# EAGLE schematic bend_it_board_v_2_F (EAGLE 9.3.1)
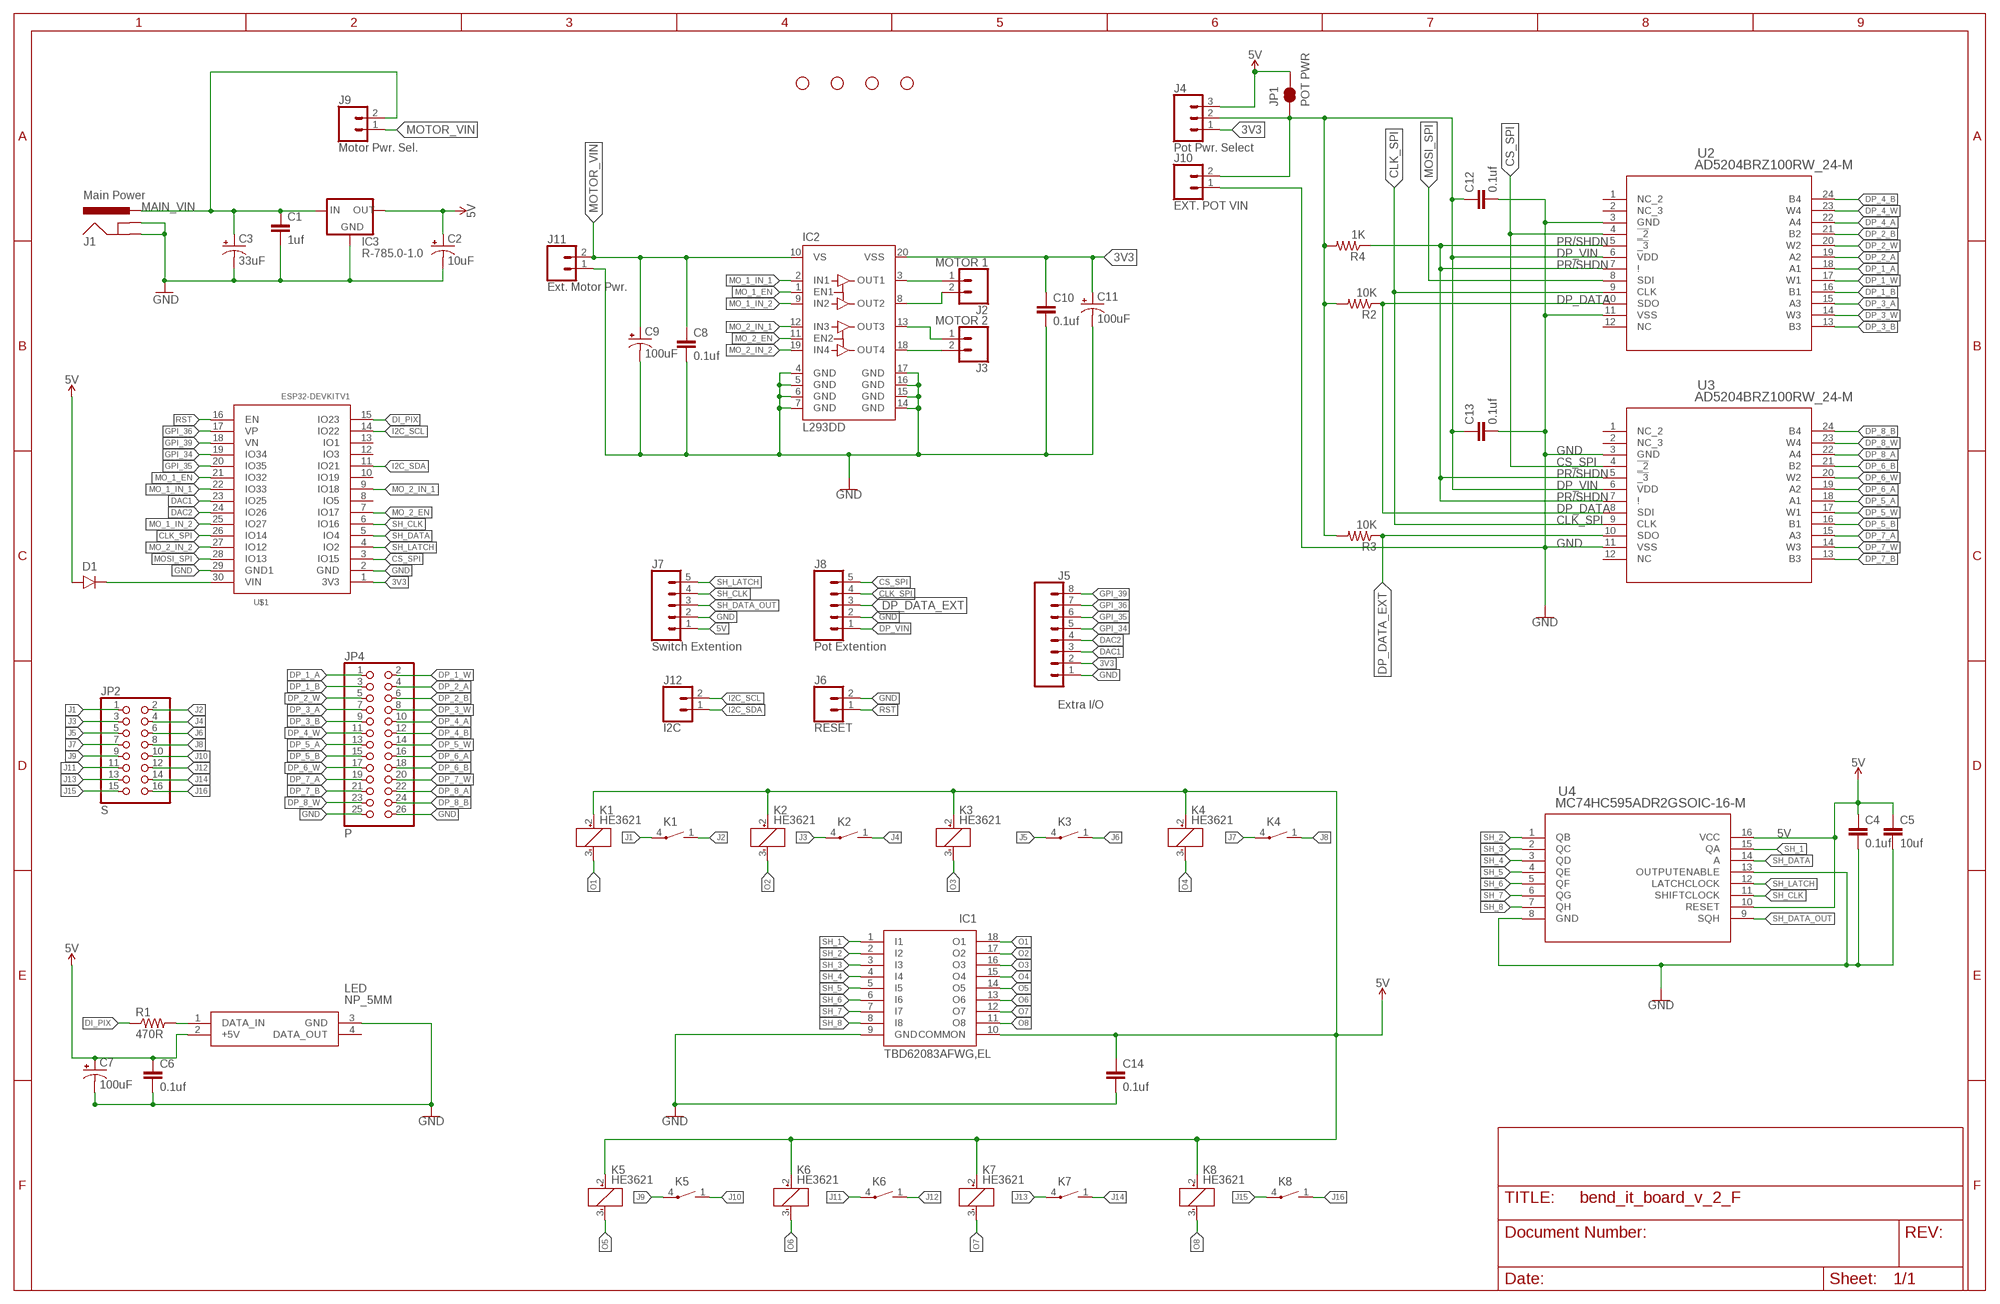
[diagram p0: schematic, sheet 1]

## Parts
C1  1uf  C-EUC0805  [C0805]
C2  10uF  CPOL-USB  [PANASONIC_B]
C3  33uF  CPOL-USD  [PANASONIC_D]
C4  0.1uf  C-EUC0805  [C0805]
C5  10uf  C-EUC0805  [C0805]
C6  0.1uf  C-EUC0805  [C0805]
C7  100uF  CPOL-USD  [PANASONIC_D]
C8  0.1uf  C-EUC0805  [C0805]
C9  100uF  CPOL-USD  [PANASONIC_D]
C10  0.1uf  C-EUC0805  [C0805]
C11  100uF  CPOL-USD  [PANASONIC_D]
C12  0.1uf  C-EUC0805  [C0805]
C13  0.1uf  C-EUC0805  [C0805]
C14  0.1uf  C-EUC0805  [C0805]
D1  1N4001  [DO41-10]
H1  STAND-OFF  [STAND-OFF]
H2  STAND-OFF  [STAND-OFF]
H3  STAND-OFF  [STAND-OFF]
H4  STAND-OFF  [STAND-OFF]
IC1  TBD62083AFWG,EL  [SOIC127P1032X285-18N]
IC2  L293DD  [SO20]
IC3  R-785.0-1.0  [SIP3]
J1  Main Power  POWER_JACK  [POWER_JACK_PTH]
J2  MOTOR 1  CONN_025MM  [SCREWTERMINAL-5MM-2]
J3  MOTOR 2  CONN_025MM  [SCREWTERMINAL-5MM-2]
J4  Pot Pwr. Select  CONN_03  [1X03]
J5  Extra I/O  CONN_08"  [1X08]
J6  RESET  CONN_02  [1X02]
J7  Switch Extention  CONN_05  [1X05]
J8  Pot Extention  CONN_05  [1X05]
J9  Motor Pwr. Sel.  CONN_02  [1X02]
J10  EXT. POT VIN  CONN_02LOCK_LONGPADS  [1X02_LOCK_LONGPADS]
J11  Ext. Motor Pwr.  CONN_02LOCK_LONGPADS  [1X02_LOCK_LONGPADS]
J12  I2C  CONN_02  [1X02]
JP1  POT PWR  JUMPER-SMT_2_NC_TRACE_SILK  [SMT-JUMPER_2_NC_TRACE_SILK]
JP2  S  PINHD-2X8  [2X08]
JP4  P  PINHD-2X13  [2X13]
K1  HE3621  [HE3621]
K2  HE3621  [HE3621]
K3  HE3621  [HE3621]
K4  HE3621  [HE3621]
K5  HE3621  [HE3621]
K6  HE3621  [HE3621]
K7  HE3621  [HE3621]
K8  HE3621  [HE3621]
LED  NP_5MM  1938  [1938]
R1  470R  R-US_R0805  [R0805]
R2  10K  R-US_R0805  [R0805]
R3  10K  R-US_R0805  [R0805]
R4  1K  R-US_R0805  [R0805]
U2  AD5204BRZ100RW_24-M  [RW_24-M]
U3  AD5204BRZ100RW_24-M  [RW_24-M]
U4  MC74HC595ADR2GSOIC-16-M  [SOIC-16-M]
U$1  ESP32DEVKITV1  [ESP32-DEVKITV1]

## Nets
3V3 [PWR]: C10.1 C11.+ IC2.20(VSS) J4.1 J5.2 U$1.1(3V3)
5V [PWR]: C2.+ C4.1 C5.1 C6.1 C7.+ C14.1 D1.A(ANODE) IC1.10(COMMON) IC3.3(OUT) J4.3 J7.1 JP1.2 K1.2(1:+) K2.2(1:+) K3.2(1:+) K4.2(1:+) K5.2(1:+) K6.2(1:+) K7.2(1:+) K8.2(1:+) LED.2(+5V) U4.10(RESET) U4.16(VCC)
CLK_SPI: J8.4 U2.9(CLK) U3.9(CLK) U$1.26(IO14)
CS_SPI: J8.5 U2.4(!_2) U3.4(!_2) U$1.3(IO15)
DAC1: J5.3 U$1.23(IO25)
DAC2: J5.4 U$1.24(IO26)
DI_PIX: R1.1 U$1.15(IO23)
DP_1_A: JP4.1 U2.18(A1)
DP_1_B: JP4.3 U2.16(B1)
DP_1_W: JP4.2 U2.17(W1)
DP_2_A: JP4.4 U2.19(A2)
DP_2_B: JP4.6 U2.21(B2)
DP_2_W: JP4.5 U2.20(W2)
DP_3_A: JP4.7 U2.15(A3)
DP_3_B: JP4.9 U2.13(B3)
DP_3_W: JP4.8 U2.14(W3)
DP_4_A: JP4.10 U2.22(A4)
DP_4_B: JP4.12 U2.24(B4)
DP_4_W: JP4.11 U2.23(W4)
DP_5_A: JP4.13 U3.18(A1)
DP_5_B: JP4.15 U3.16(B1)
DP_5_W: JP4.14 U3.17(W1)
DP_6_A: JP4.16 U3.19(A2)
DP_6_B: JP4.18 U3.21(B2)
DP_6_W: JP4.17 U3.20(W2)
DP_7_A: JP4.19 U3.15(A3)
DP_7_B: JP4.21 U3.13(B3)
DP_7_W: JP4.20 U3.14(W3)
DP_8_A: JP4.22 U3.22(A4)
DP_8_B: JP4.24 U3.24(B4)
DP_8_W: JP4.23 U3.23(W4)
DP_DATA: R2.1 U2.10(SDO) U3.8(SDI)
DP_DATA_EXT: J8.3 R3.1 U3.10(SDO)
DP_VIN [PWR]: C12.1 C13.1 J4.2 J8.1 J10.2 JP1.1 R2.2 R3.2 R4.2 U2.6(VDD) U3.6(VDD)
GND [GND]: C1.2 C2.- C3.- C4.2 C5.2 C6.2 C7.- C8.2 C9.- C10.2 C11.- C12.2 C13.2 C14.2 IC1.9(GND) IC2.4(GND) IC2.5(GND) IC2.6(GND) IC2.7(GND) IC2.14(GND) IC2.15(GND) IC2.16(GND) IC2.17(GND) IC3.2(GND) J1.GND J1.GNDBREAK J5.1 J6.2 J7.2 J8.2 J10.1 J11.1 JP4.25 JP4.26 LED.3(GND) U2.3(GND) U2.11(VSS) U3.3(GND) U3.11(VSS) U4.8(GND) U4.13(OUTPUTENABLE) U$1.2(GND) U$1.29(GND1)
GPI_34: J5.5 U$1.19(IO34)
GPI_35: J5.6 U$1.20(IO35)
GPI_36: J5.7 U$1.17(VP)
GPI_39: J5.8 U$1.18(VN)
I2C_SCL: J12.2 U$1.14(IO22)
I2C_SDA: J12.1 U$1.11(IO21)
J1: JP2.1 K1.4(2:P)
J2: JP2.2 K1.1(2:S)
J3: JP2.3 K2.4(2:P)
J4: JP2.4 K2.1(2:S)
J5: JP2.5 K3.4(2:P)
J6: JP2.6 K3.1(2:S)
J7: JP2.7 K4.4(2:P)
J8: JP2.8 K4.1(2:S)
J9: JP2.9 K5.4(2:P)
J10: JP2.10 K5.1(2:S)
J11: JP2.11 K6.4(2:P)
J12: JP2.12 K6.1(2:S)
J13: JP2.13 K7.4(2:P)
J14: JP2.14 K7.1(2:S)
J15: JP2.15 K8.4(2:P)
J16: JP2.16 K8.1(2:S)
MAIN_VIN [PWR]: C1.1 C3.+ IC3.1(IN) J1.PWR J9.2
MO_1_EN: IC2.1(EN1) U$1.21(IO32)
MO_1_IN_1: IC2.2(IN1) U$1.22(IO33)
MO_1_IN_2: IC2.9(IN2) U$1.25(IO27)
MO_2_EN: IC2.11(EN2) U$1.7(IO17)
MO_2_IN_1: IC2.12(IN3) U$1.9(IO18)
MO_2_IN_2: IC2.19(IN4) U$1.27(IO12)
MOSI_SPI: U2.8(SDI) U$1.28(IO13)
MOTOR_1_OUT [PWR]: IC2.3(OUT1) J2.1
MOTOR_2_OUT [PWR]: IC2.8(OUT2) J2.2
MOTOR_3_OUT [PWR]: IC2.13(OUT3) J3.1
MOTOR_4_OUT [PWR]: IC2.18(OUT4) J3.2
MOTOR_VIN [PWR]: C8.1 C9.+ IC2.10(VS) J9.1 J11.2
N$1: D1.C(CATHODE) U$1.30(VIN)
N$11: LED.1(DATA_IN) R1.2
O1: IC1.18(O1) K1.3(1:-)
O2: IC1.17(O2) K2.3(1:-)
O3: IC1.16(O3) K3.3(1:-)
O4: IC1.15(O4) K4.3(1:-)
O5: IC1.14(O5) K5.3(1:-)
O6: IC1.13(O6) K6.3(1:-)
O7: IC1.12(O7) K7.3(1:-)
O8: IC1.11(O8) K8.3(1:-)
PR/SHDN: R4.1 U2.5(!_3) U2.7(!) U3.5(!_3) U3.7(!)
RST: J6.1 U$1.16(EN)
SH_1: IC1.1(I1) U4.15(QA)
SH_2: IC1.2(I2) U4.1(QB)
SH_3: IC1.3(I3) U4.2(QC)
SH_4: IC1.4(I4) U4.3(QD)
SH_5: IC1.5(I5) U4.4(QE)
SH_6: IC1.6(I6) U4.5(QF)
SH_7: IC1.7(I7) U4.6(QG)
SH_8: IC1.8(I8) U4.7(QH)
SH_CLK: J7.4 U4.11(SHIFTCLOCK) U$1.6(IO16)
SH_DATA: U4.14(A) U$1.5(IO4)
SH_DATA_OUT: J7.3 U4.9(SQH)
SH_LATCH: J7.5 U4.12(LATCHCLOCK) U$1.4(IO2)
Unconnected: LED.4(DATA_OUT) U2.1(NC_2) U2.2(NC_3) U2.12(NC) U3.1(NC_2) U3.2(NC_3) U3.12(NC) U$1.8(IO5) U$1.10(IO19) U$1.12(IO3) U$1.13(IO1)

## Library data of the parts
C1 C4-C6 C8 C10 C12-C14 = rcl:C-EU: CAPACITOR, European symbol
C2 C3 C7 C9 C11 = rcl:CPOL-US: POLARIZED CAPACITOR, American symbol; SPICEPREFIX: C
D1 = tango:1N4001: DIODE general purpose rectifier, 1 A
H1-H4 = SparkFun-Hardware:STAND-OFF: Stand Off Drill holes for mechanically mounting via screws, standoffs, etc. Note: Use the keepout ring to avoid running the screw head into surrounding components. Variant Overviews STAND-OFF - Mechanical footprint for a #4 phillips button head screw. STAND-OFF-TIGHT - Mechanical footprint for a #4 phillips button head screw, Example SparkFun Products Screw - Phillips Head (1/4", 4-40, 10 pack) <https://www.sparkfun.com/products/10453> (PRT-10453) Screw - Phillips Head (1/2", 4-40, 10 pack) <https://www.sparkfun.com/products/10452> (PRT-10452) Screw - Phillips Head (3/4", 4-40, 10 pack) <https://www.sparkfun.com/products/10451> (PRT-10451) Screw - Phillips Head (1", 4-40, 10 pack) <https://www.sparkfun.com/products/10450> (PRT-10450)
IC1 = 2821:TBD62083AFWG,EL: Gate Drivers DMOS Transistor Array 8-CH, 50V/0.5A Source: Datasheet <http://www.mouser.com/ds/2/408/TBD62083AFWG_datasheet_en_20160511-769679.pdf>; DESCRIPTION: Gate Drivers DMOS Transistor Array 8-CH, 50V/0.5A; HEIGHT: 2.85mm; MANUFACTURER_NAME: Toshiba; MANUFACTURER_PART_NUMBER: TBD62083AFWG,EL; MOUSER_PART_NUMBER: 757-TBD62083AFWGEL; MOUSER_PRICE-STOCK: https://www.mouser.com/Search/Refine.aspx?Keyword=757-TBD62083AFWGEL
IC2 = st-microelectronics:L293DD: PUSH-PULL FOUR CHANNEL DRIVER WITH DIODES Source: http://www.st.com/stonline/books/pdf/docs/1330.pdf; OC_FARNELL: unknown
IC3 = r-78xx_10:R-78*-1.0: Innoline R-78xx-1.0 Series Switching Regulators - 1.0A, Standard Source: http://www.recom-international.com/pdf/Innoline/R-78xx-1.0.pdf; MF: Recom; MPN: R-785.0-1.0; OC_FARNELL: 1793143; OC_NEWARK: 62X9542
J1 = SparkFun-Connectors:POWER_JACK: Power Jack Connector This is the standard 5.5mm barrel jack for power. The PTH is the most common, proven, reliable, footprint. The Slot footprint only works if the mill layer is transmitted to the PCB fab house so be warned. Here are the connectors we sell at SparkFun: DC Barrel Power Jack/Connector <https://www.sparkfun.com/products/119> (PRT-00119) DC Barrel Power Jack/Connector (SMD) <https://www.sparkfun.com/products/12748> (PRT-12748) DC Barrel Jack Adapter - Breadboard Compatible <https://www.sparkfun.com/products/10811> (PRT-10811) It is used on this SparkFun product (and many, many others): SparkFun RedBoard - Programmed with Arduino <https://www.sparkfun.com/products/12757> (DEV-12757) Also, if you need a mating power supply or connector, please check these out: Wall Adapter Power Supply - 9VDC 650mA <https://www.sparkfun.com/products/298> (TOL-00298) DC Barrel Jack Adapter - Male <https://www.sparkfun.com/products/10287> (PRT-10287); PROD_ID: CONN-08197
J2 J3 = SparkFun-Connectors:CONN_02: Multi connection point. Often used as Generic Header-pin footprint for 0.1 inch spaced/style header connections On any of the 0.1 inch spaced packages, you can populate with these: Break Away Headers - Straight <https://www.sparkfun.com/products/116> (PRT-00116) Break Away Male Headers - Right Angle <https://www.sparkfun.com/products/553> (PRT-00553) Female Headers <https://www.sparkfun.com/products/115> (PRT-00115) Break Away Headers - Machine Pin <https://www.sparkfun.com/products/117> (PRT-00117) Break Away Female Headers - Swiss Machine Pin <https://www.sparkfun.com/products/743> (PRT-00743) For SCREWTERMINALS and SPRING TERMINALS visit here: Screw Terimnals on SparkFun.com <https://www.sparkfun.com/search/results?term=Screw+Terminals> (5mm/3.5mm/2.54mm spacing) This device is also useful as a general connection point to wire up your design to another part of your project. Our various solder wires solder well into these plated through hole pads. Hook-Up Wire - Assortment (Stranded, 22 AWG) <https://www.sparkfun.com/products/11375> (PRT-11375) Hook-Up Wire - Assortment (Solid Core, 22 AWG) <https://www.sparkfun.com/products/11367> (PRT-11367) View the entire wire category on our website here <https://www.sparkfun.com/categories/141> Special notes: Molex polarized connector foot print use with: PRT-08233 with associated crimp pins and housings. 2.54_SCREWTERM for use with PRT-10571. 3.5mm Screw Terminal footprints for PRT-08084 5mm Screw Terminal footprints for use with PRT-08432; SF_SKU: PRT-08432
J4 = SparkFun-Connectors:CONN_03: Multi connection point. Often used as Generic Header-pin footprint for 0.1 inch spaced/style header connections On any of the 0.1 inch spaced packages, you can populate with these: Break Away Headers - Straight <https://www.sparkfun.com/products/116> (PRT-00116) Break Away Male Headers - Right Angle <https://www.sparkfun.com/products/553> (PRT-00553) Female Headers <https://www.sparkfun.com/products/115> (PRT-00115) Break Away Headers - Machine Pin <https://www.sparkfun.com/products/117> (PRT-00117) Break Away Female Headers - Swiss Machine Pin <https://www.sparkfun.com/products/743> (PRT-00743) Stackable Header - 3 Pin (Female, 0.1") <https://www.sparkfun.com/products/13875> (PRT-13875) For SCREWTERMINALS and SPRING TERMINALS visit here: Screw Terimnals on SparkFun.com <https://www.sparkfun.com/search/results?term=Screw+Terminals> (5mm/3.5mm/2.54mm spacing) This device is also useful as a general connection point to wire up your design to another part of your project. Our various solder wires solder well into these plated through hole pads. Hook-Up Wire - Assortment (Stranded, 22 AWG) <https://www.sparkfun.com/products/11375> (PRT-11375) Hook-Up Wire - Assortment (Solid Core, 22 AWG) <https://www.sparkfun.com/products/11367> (PRT-11367) View the entire wire category on our website here <https://www.sparkfun.com/categories/141> Special notes: Molex polarized connector foot print use with SKU : PRT-08232 with associated crimp pins and housings.
J5 = SparkFun-Connectors:CONN_08: Multi connection point. Often used as Generic Header-pin footprint for 0.1 inch spaced/style header connections On any of the 0.1 inch spaced packages, you can populate with these: Break Away Headers - Straight <https://www.sparkfun.com/products/116> (PRT-00116) Break Away Male Headers - Right Angle <https://www.sparkfun.com/products/553> (PRT-00553) Female Headers <https://www.sparkfun.com/products/115> (PRT-00115) Break Away Headers - Machine Pin <https://www.sparkfun.com/products/117> (PRT-00117) Break Away Female Headers - Swiss Machine Pin <https://www.sparkfun.com/products/743> (PRT-00743) Arduino Stackable Header - 8 Pin <https://www.sparkfun.com/products/9279> (PRT-09279) For SCREWTERMINALS and SPRING TERMINALS visit here: Screw Terimnals on SparkFun.com <https://www.sparkfun.com/search/results?term=Screw+Terminals> (5mm/3.5mm/2.54mm spacing) This device is also useful as a general connection point to wire up your design to another part of your project. Our various solder wires solder well into these plated through hole pads. Hook-Up Wire - Assortment (Stranded, 22 AWG) <https://www.sparkfun.com/products/11375> (PRT-11375) Hook-Up Wire - Assortment (Solid Core, 22 AWG) <https://www.sparkfun.com/products/11367> (PRT-11367) View the entire wire category on our website here <https://www.sparkfun.com/categories/141> Special notes: Molex polarized connector foot print use with SKU : PRT-08231 with associated crimp pins and housings. 1MM SMD Version SKU: PRT-10208 NOTES ON THE VARIANTS LOCK and LOCK_LONGPADS... This footprint was designed to help hold the alignment of a through-hole component (i.e. 6-pin header) while soldering it into place. You may notice that each hole has been shifted either up or down by 0.005 of an inch from it's more standard position (which is a perfectly straight line). This slight alteration caused the pins (the squares in the middle) to touch the edges of the holes. Because they are alternating, it causes a "brace" to hold the component in place. 0.005 has proven to be the perfect amount of "off-center" position when using our standard breakaway headers. Although looks a little odd when you look at the bare footprint, once you have a header in there, the alteration is very hard to notice. Also,if you push a header all the way into place, it is covered up entirely on the bottom side.; PROD_ID: CONN-08438
J6 J9-J12 = SparkFun-Connectors:CONN_02: Multi connection point. Often used as Generic Header-pin footprint for 0.1 inch spaced/style header connections On any of the 0.1 inch spaced packages, you can populate with these: Break Away Headers - Straight <https://www.sparkfun.com/products/116> (PRT-00116) Break Away Male Headers - Right Angle <https://www.sparkfun.com/products/553> (PRT-00553) Female Headers <https://www.sparkfun.com/products/115> (PRT-00115) Break Away Headers - Machine Pin <https://www.sparkfun.com/products/117> (PRT-00117) Break Away Female Headers - Swiss Machine Pin <https://www.sparkfun.com/products/743> (PRT-00743) For SCREWTERMINALS and SPRING TERMINALS visit here: Screw Terimnals on SparkFun.com <https://www.sparkfun.com/search/results?term=Screw+Terminals> (5mm/3.5mm/2.54mm spacing) This device is also useful as a general connection point to wire up your design to another part of your project. Our various solder wires solder well into these plated through hole pads. Hook-Up Wire - Assortment (Stranded, 22 AWG) <https://www.sparkfun.com/products/11375> (PRT-11375) Hook-Up Wire - Assortment (Solid Core, 22 AWG) <https://www.sparkfun.com/products/11367> (PRT-11367) View the entire wire category on our website here <https://www.sparkfun.com/categories/141> Special notes: Molex polarized connector foot print use with: PRT-08233 with associated crimp pins and housings. 2.54_SCREWTERM for use with PRT-10571. 3.5mm Screw Terminal footprints for PRT-08084 5mm Screw Terminal footprints for use with PRT-08432
J7 J8 = SparkFun-Connectors:CONN_05: Multi connection point. Often used as Generic Header-pin footprint for 0.1 inch spaced/style header connections On any of the 0.1 inch spaced packages, you can populate with these: Break Away Headers - Straight <https://www.sparkfun.com/products/116> (PRT-00116) Break Away Male Headers - Right Angle <https://www.sparkfun.com/products/553> (PRT-00553) Female Headers <https://www.sparkfun.com/products/115> (PRT-00115) Break Away Headers - Machine Pin <https://www.sparkfun.com/products/117> (PRT-00117) Break Away Female Headers - Swiss Machine Pin <https://www.sparkfun.com/products/743> (PRT-00743) For SCREWTERMINALS and SPRING TERMINALS visit here: Screw Terimnals on SparkFun.com <https://www.sparkfun.com/search/results?term=Screw+Terminals> (5mm/3.5mm/2.54mm spacing) This device is also useful as a general connection point to wire up your design to another part of your project. Our various solder wires solder well into these plated through hole pads. Hook-Up Wire - Assortment (Stranded, 22 AWG) <https://www.sparkfun.com/products/11375> (PRT-11375) Hook-Up Wire - Assortment (Solid Core, 22 AWG) <https://www.sparkfun.com/products/11367> (PRT-11367) View the entire wire category on our website here <https://www.sparkfun.com/categories/141> Special notes: Molex polarized connector foot print use with SKU : PRT-08231 with associated crimp pins and housings. 1MM SMD Version SKU: PRT-10208
JP1 = SparkFun-Jumpers:JUMPER-SMT_2_NC_TRACE: Normally closed trace jumper This jumper has a trace between two pads so it's normally closed (NC). Use a razor knife to open the connection. For best results follow the IPC guidelines for cutting traces: Cutout at least 0.063 mm (0.005 in). Remove all loose material to clean up the cut area. Seal the cut with an approved epoxy. Reapply solder to reclose the connection.
JP2 = pinhead:PINHD-2X8: PIN HEADER
JP4 = pinhead:PINHD-2X13: PIN HEADER
K1-K8 = relay:HE3621: RELAY reed, 1 x norm. open, grid 5.08 mm, Hamlin; MF: HAMLIN; MPN: HE3621A2410; OC_FARNELL: 9561943; OC_NEWARK: 50F7993
LED = 1938:1938: ADAFRUIT - 1938 - LED Color:Red, Green, Blue Source: Datasheet <https://www.adafruit.com/product/1938>; DESCRIPTION: ADAFRUIT - 1938 - LED Color:Red, Green, Blue; HEIGHT: mm; MANUFACTURER_NAME: Adafruit; MANUFACTURER_PART_NUMBER: 1938; MOUSER_PART_NUMBER: 485-1938; MOUSER_PRICE-STOCK: https://www.mouser.com/Search/Refine.aspx?Keyword=485-1938; RS_PART_NUMBER: 485-1938; RS_PRICE-STOCK: https://www.mouser.com/Search/Refine.aspx?Keyword=485-1938
R1-R4 = rcl:R-US_: RESISTOR, American symbol
U2 U3 = AD5204BR100:AD5204BRZ100; MANUFACTURER_PART_NUMBER: AD5204BRZ100; VENDOR: Analog Devices Inc
U4 = MC74HC595:MC74HC595ADR2G; MANUFACTURER_PART_NUMBER: MC74HC595ADR2G; VENDOR: ON Semiconductor
U$1 = ESP32-DEVKITV1:ESP32DEVKITV1

## Net classes
0 default: width 0.254 mm, clearance 0.203 mm
1 PWR: width 0.991 mm, clearance 0.203 mm
2 GND: width 0.508 mm, clearance 0.203 mm